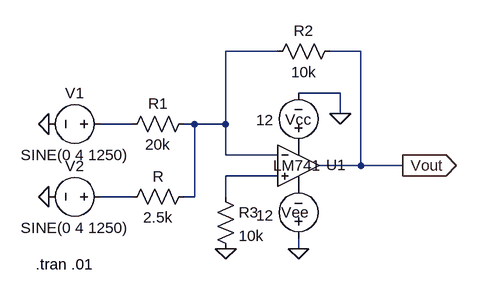
[diagram p0: schematic partB.asc]
partB.asc, the LTspice schematic file:
Version 4
SHEET 1 880 680
WIRE 144 32 64 32
WIRE 272 32 224 32
WIRE 240 96 176 96
WIRE 240 128 240 96
WIRE -80 144 -128 144
WIRE 16 144 0 144
WIRE 64 144 64 32
WIRE 64 144 16 144
WIRE 64 192 64 144
WIRE 144 192 64 192
WIRE 272 208 272 32
WIRE 272 208 208 208
WIRE 336 208 272 208
WIRE 144 224 64 224
WIRE -80 256 -128 256
WIRE 16 256 16 144
WIRE 16 256 0 256
WIRE 64 256 64 224
WIRE 176 336 176 320
FLAG 240 128 0
FLAG 176 336 0
FLAG 336 208 Vout
IOPIN 336 208 Out
FLAG -208 144 0
FLAG -208 256 0
FLAG 64 336 0
SYMBOL LM741 176 144 R0
WINDOW 0 43 63 Left 2
WINDOW 3 -39 64 Left 2
SYMATTR InstName U1
SYMBOL res 16 128 R90
WINDOW 0 0 56 VBottom 2
WINDOW 3 32 56 VTop 2
SYMATTR InstName R1
SYMATTR Value 20k
SYMBOL res 240 16 R90
WINDOW 0 0 56 VBottom 2
WINDOW 3 32 56 VTop 2
SYMATTR InstName R2
SYMATTR Value 10k
SYMBOL res 16 240 R90
WINDOW 0 0 56 VBottom 2
WINDOW 3 32 56 VTop 2
SYMATTR InstName R
SYMATTR Value 2.5k
SYMBOL voltage 176 192 R180
WINDOW 0 -19 55 Left 2
WINDOW 3 38 54 Left 2
WINDOW 123 0 0 Left 0
WINDOW 39 0 0 Left 0
SYMATTR InstName Vcc
SYMATTR Value 12
SYMBOL voltage 176 336 R180
WINDOW 0 -16 56 Left 2
WINDOW 3 38 51 Left 2
WINDOW 123 0 0 Left 0
WINDOW 39 0 0 Left 0
SYMATTR InstName Vee
SYMATTR Value 12
SYMBOL voltage -112 144 R90
WINDOW 0 -32 56 VBottom 2
WINDOW 3 32 56 VTop 2
WINDOW 123 0 0 Left 0
WINDOW 39 0 0 Left 0
SYMATTR InstName V1
SYMATTR Value SINE(0 4 1250)
SYMBOL voltage -112 256 R90
WINDOW 0 -32 56 VBottom 2
WINDOW 3 32 56 VTop 2
WINDOW 123 0 0 Left 0
WINDOW 39 0 0 Left 0
SYMATTR InstName V2
SYMATTR Value SINE(0 4 1250)
SYMBOL res 48 240 R0
SYMATTR InstName R3
SYMATTR Value 10k
TEXT -228 360 Left 2 !.tran .01

The netlist it stands for:
* partB.asc
XU1 N003 N001 P001 P002 Vout LM741  ; pins In+ In- V+ V- OUT
R1 N001 N002 20k
R2 Vout N001 10k
R N001 N004 2.5k
Vcc P001 0 12
Vee 0 P002 12
V1 N002 0 SINE(0 4 1250)
V2 N004 0 SINE(0 4 1250)
R3 N003 0 10k
.tran .01
.lib LM741.lib
.backanno
.end